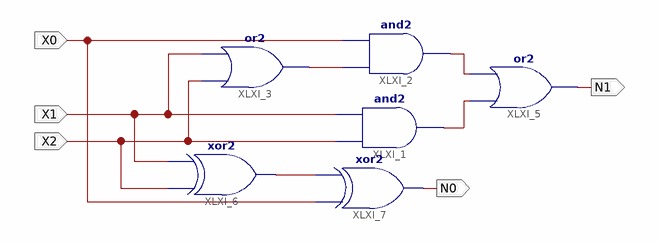
[diagram p0: schematic sheet 1]
// Xilinx ISE schematic problem1.sch (spartan3a) as structural Verilog: 6 symbols, 5 ports
module problem1 (
  input  X0,
  input  X2,
  input  X1,
  output N1,
  output N0
);

  wire XLXN_8, XLXN_13, XLXN_14, XLXN_17;

  and XLXI_1 (XLXN_14, X2, X1);
  or XLXI_3 (XLXN_8, X2, X1);
  and XLXI_2 (XLXN_13, XLXN_8, X0);
  or XLXI_5 (N1, XLXN_14, XLXN_13);
  xor XLXI_6 (XLXN_17, X2, X1);
  xor XLXI_7 (N0, X0, XLXN_17);
endmodule
